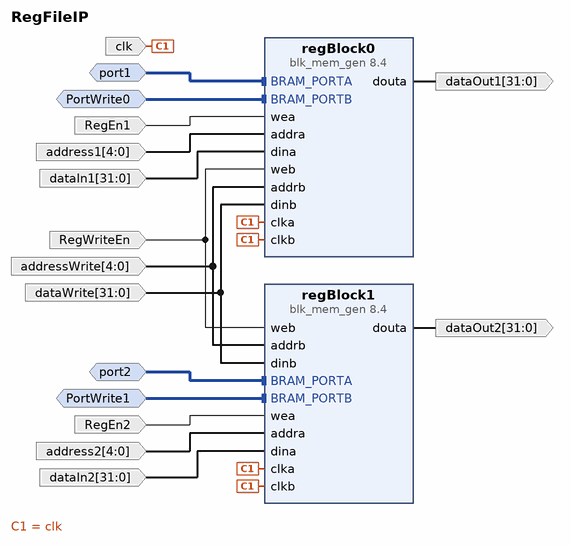
[diagram p0: block diagram of the top level]
# Vivado block design RegFileIP, xc7z010clg400-1, Vivado 2023.2
create_bd_design RegFileIP

create_bd_intf_port -mode Slave -vlnv xilinx.com:interface:bram_rtl:1.0 port1
create_bd_intf_port -mode Slave -vlnv xilinx.com:interface:bram_rtl:1.0 PortWrite0
create_bd_intf_port -mode Slave -vlnv xilinx.com:interface:bram_rtl:1.0 port2
create_bd_intf_port -mode Slave -vlnv xilinx.com:interface:bram_rtl:1.0 PortWrite1
create_bd_port -dir I -type clk clk
set_property -dict {CONFIG.FREQ_HZ 125000000} [get_bd_ports clk]
create_bd_port -dir I -from 4 -to 0 address1
create_bd_port -dir I -from 4 -to 0 addressWrite
create_bd_port -dir I -from 4 -to 0 address2
create_bd_port -dir I -from 31 -to 0 -type data dataIn1
create_bd_port -dir I -from 31 -to 0 -type data dataWrite
create_bd_port -dir I -from 31 -to 0 -type data dataIn2
create_bd_port -dir O -from 31 -to 0 -type data dataOut1
create_bd_port -dir O -from 31 -to 0 -type data dataOut2
create_bd_port -dir I RegWriteEn
create_bd_port -dir I RegEn2
create_bd_port -dir I RegEn1

create_bd_cell -type ip -vlnv xilinx.com:ip:blk_mem_gen:8.4 regBlock0
set_property -dict [list \
  CONFIG.Enable_A Always_Enabled \
  CONFIG.Enable_B Always_Enabled \
  CONFIG.Fill_Remaining_Memory_Locations true \
  CONFIG.Memory_Type True_Dual_Port_RAM \
  CONFIG.Register_PortA_Output_of_Memory_Primitives false \
  CONFIG.Register_PortB_Output_of_Memory_Primitives false \
  CONFIG.Write_Depth_A 32 \
  CONFIG.use_bram_block Stand_Alone \
] [get_bd_cells regBlock0]
create_bd_cell -type ip -vlnv xilinx.com:ip:blk_mem_gen:8.4 regBlock1
set_property -dict [list \
  CONFIG.Enable_A Always_Enabled \
  CONFIG.Enable_B Always_Enabled \
  CONFIG.Fill_Remaining_Memory_Locations true \
  CONFIG.Memory_Type True_Dual_Port_RAM \
  CONFIG.Register_PortA_Output_of_Memory_Primitives false \
  CONFIG.Register_PortB_Output_of_Memory_Primitives false \
  CONFIG.Write_Depth_A 32 \
  CONFIG.use_bram_block Stand_Alone \
] [get_bd_cells regBlock1]

# ---- connections ----

connect_bd_intf_net -intf_net BRAM_PORTA_0_1 [get_bd_intf_ports port1] [get_bd_intf_pins regBlock0/BRAM_PORTA]
connect_bd_intf_net -intf_net BRAM_PORTA_1_1 [get_bd_intf_ports port2] [get_bd_intf_pins regBlock1/BRAM_PORTA]
connect_bd_intf_net -intf_net BRAM_PORTB_0_1 [get_bd_intf_ports PortWrite0] [get_bd_intf_pins regBlock0/BRAM_PORTB]
connect_bd_intf_net -intf_net BRAM_PORTB_0_2 [get_bd_intf_ports PortWrite1] [get_bd_intf_pins regBlock1/BRAM_PORTB]
connect_bd_net [get_bd_ports clk] [get_bd_pins regBlock0/clka] [get_bd_pins regBlock1/clka] [get_bd_pins regBlock0/clkb] [get_bd_pins regBlock1/clkb]
connect_bd_net -net RegEn0_1 [get_bd_ports RegEn1] [get_bd_pins regBlock0/wea]
connect_bd_net -net RegEn1_1 [get_bd_ports RegWriteEn] [get_bd_pins regBlock0/web] [get_bd_pins regBlock1/web]
connect_bd_net -net RegEn2_1 [get_bd_ports RegEn2] [get_bd_pins regBlock1/wea]
connect_bd_net -net address0_1 [get_bd_ports address1] [get_bd_pins regBlock0/addra]
connect_bd_net -net address1_1 [get_bd_ports addressWrite] [get_bd_pins regBlock0/addrb] [get_bd_pins regBlock1/addrb]
connect_bd_net -net address2_1 [get_bd_ports address2] [get_bd_pins regBlock1/addra]
connect_bd_net -net dataIn0_1 [get_bd_ports dataIn1] [get_bd_pins regBlock0/dina]
connect_bd_net -net dataIn1_1 [get_bd_ports dataWrite] [get_bd_pins regBlock0/dinb] [get_bd_pins regBlock1/dinb]
connect_bd_net -net dataIn2_1 [get_bd_ports dataIn2] [get_bd_pins regBlock1/dina]
connect_bd_net [get_bd_pins regBlock0/douta] [get_bd_ports dataOut1]
connect_bd_net [get_bd_pins regBlock1/douta] [get_bd_ports dataOut2]

validate_bd_design
save_bd_design
